# Altium project Marsault1.PrjPcb (part 3 of 7)

## Sheet MEMORIES.SchDoc
size A4; SheetNumber: 3; SheetTotal: 9
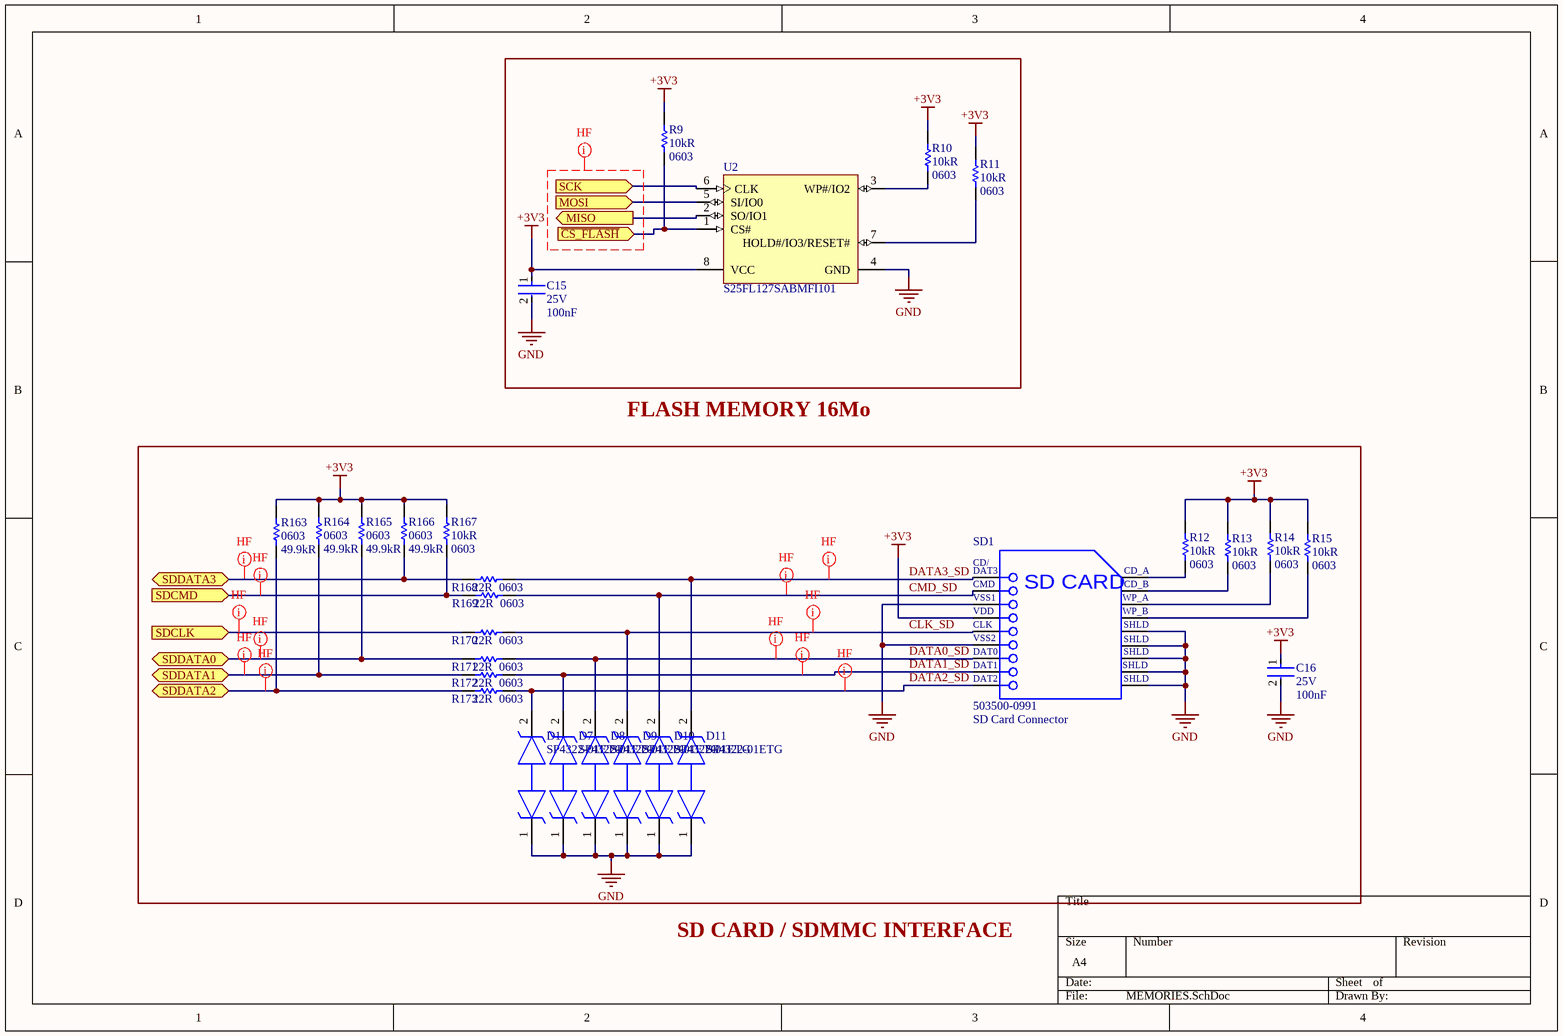
[diagram p2: MEMORIES.SchDoc]

### Parts
C15  Voltage Rating (DC): 25V  Capacitance: 100nF  [FP-CGA3E-0_3-0_1-MFG]  (hidden comment: CGA3E2X7R1E104K080AA)
C16  Voltage Rating (DC): 25V  Capacitance: 100nF  [FP-CGA3E-0_3-0_1-MFG]  (hidden comment: CGA3E2X7R1E104K080AA)
D1  SP4322-01ETG  [SP432201ETG]
D7  SP4322-01ETG  [SP432201ETG]
D8  SP4322-01ETG  [SP432201ETG]
D9  SP4322-01ETG  [SP432201ETG]
D10  SP4322-01ETG  [SP432201ETG]
D11  SP4322-01ETG  [SP432201ETG]
R9  Resistance: 10kR  Case Code (Imperial): 0603  [RESC1609X55X30LL15T15]  (hidden comment: ERJ3EKF1002V)
R10  Resistance: 10kR  Case Code (Imperial): 0603  [RESC1609X55X30LL15T15]  (hidden comment: ERJ3EKF1002V)
R11  Resistance: 10kR  Case Code (Imperial): 0603  [RESC1609X55X30LL15T15]  (hidden comment: ERJ3EKF1002V)
R12  Resistance: 10kR  Case Code (Imperial): 0603  [RESC1609X55X30LL15T15]  (hidden comment: ERJ3EKF1002V)
R13  Resistance: 10kR  Case Code (Imperial): 0603  [RESC1609X55X30LL15T15]  (hidden comment: ERJ3EKF1002V)
R14  Resistance: 10kR  Case Code (Imperial): 0603  [RESC1609X55X30LL15T15]  (hidden comment: ERJ3EKF1002V)
R15  Resistance: 10kR  Case Code (Imperial): 0603  [RESC1609X55X30LL15T15]  (hidden comment: ERJ3EKF1002V)
R163  Case Code (Imperial): 0603  Resistance: 49.9kR  [RESC1608X55X30ML15T15]  (hidden comment: ERJ-3EKF4992V)
R164  Case Code (Imperial): 0603  Resistance: 49.9kR  [RESC1608X55X30ML15T15]  (hidden comment: ERJ-3EKF4992V)
R165  Case Code (Imperial): 0603  Resistance: 49.9kR  [RESC1608X55X30ML15T15]  (hidden comment: ERJ-3EKF4992V)
R166  Case Code (Imperial): 0603  Resistance: 49.9kR  [RESC1608X55X30ML15T15]  (hidden comment: ERJ-3EKF4992V)
R167  Resistance: 10kR  Case Code (Imperial): 0603  [RESC1609X55X30LL15T15]  (hidden comment: ERJ3EKF1002V)
R168  Case Code (Imperial): 0603  Resistance: 22R  [RESC1608X55X30LL15T15]  (hidden comment: ERJ-3EKF22R0V)
R169  Case Code (Imperial): 0603  Resistance: 22R  [RESC1608X55X30LL15T15]  (hidden comment: ERJ-3EKF22R0V)
R170  Case Code (Imperial): 0603  Resistance: 22R  [RESC1608X55X30LL15T15]  (hidden comment: ERJ-3EKF22R0V)
R171  Case Code (Imperial): 0603  Resistance: 22R  [RESC1608X55X30LL15T15]  (hidden comment: ERJ-3EKF22R0V)
R172  Case Code (Imperial): 0603  Resistance: 22R  [RESC1608X55X30LL15T15]  (hidden comment: ERJ-3EKF22R0V)
R173  Case Code (Imperial): 0603  Resistance: 22R  [RESC1608X55X30LL15T15]  (hidden comment: ERJ-3EKF22R0V)
SD1  503500-0991  PackageDescription: SD Card Connector  [MOLX-503500-0991_V]
U2  S25FL127SABMFI101  [SPSN-SO-8_M]

### Ports
MISO (out), MOSI (in), SCK (in), SDCLK (in), SDCMD (in), SDDATA0 (bidir), SDDATA1 (bidir), SDDATA2 (bidir), SDDATA3 (bidir), ~{CS_FLASH} (in)

### Nets
+3V3: C15.1 C16.1 R9.2 R10.2 R11.2 R12.2 R13.2 R14.2 R15.2 R163.2 R164.2 R165.2 R166.2 R167.2 SD1.4(VDD) U2.8(VCC)
GND: C15.2 C16.2 D1.1 D7.1 D8.1 D9.1 D10.1 D11.1 SD1.3(VSS1) SD1.6(VSS2) SD1.14(SHLD1) SD1.15(SHLD2) SD1.16(SHLD3) SD1.17(SHLD4) SD1.18(SHLD5) U2.4(GND)
~{CS_FLASH}: R9.1 U2.1(CS#) ; port ~{CS_FLASH}
CLK_SD: D9.2 R170.2 SD1.5(CLK)
CMD_SD: D10.2 R169.2 SD1.2(CMD)
DATA0_SD: D8.2 R171.2 SD1.7(DAT0)
DATA1_SD: D7.2 R172.2 SD1.8(DAT1)
DATA2_SD: D1.2 R173.2 SD1.9(DAT2)
DATA3_SD: D11.2 R168.2 SD1.1(CD/DAT3)
MISO_MEM: U2.2(SO/IO1) ; port MISO
MOSI_MEM: U2.5(SI/IO0) ; port MOSI
SCK_MEM: U2.6(CLK) ; port SCK
SDCLK: R170.1 ; port SDCLK
SDCMD: R167.1 R169.1 ; port SDCMD
SDDATA0: R165.1 R171.1 ; port SDDATA0
SDDATA1: R164.1 R172.1 ; port SDDATA1
SDDATA2: R163.1 R173.1 ; port SDDATA2
SDDATA3: R166.1 R168.1 ; port SDDATA3
NetR10_1: R10.1 U2.3(WP#/IO2)
NetR11_1: R11.1 U2.7(HOLD#/IO3/RESET#)
NetR12_1: R12.1 SD1.10(CD_A)
NetR13_1: R13.1 SD1.11(CD_B)
NetR14_1: R14.1 SD1.12(WP_A)
NetR15_1: R15.1 SD1.13(WP_B)

### Layout directives
net class HF: (no net found under the mark), CLK_SD, CMD_SD, DATA0_SD, DATA1_SD, DATA2_SD, DATA3_SD, SDCLK, SDCMD, SDDATA0, SDDATA1, SDDATA2, SDDATA3

### Notes on the sheet
- FLASH MEMORY 16Mo
- SD CARD / SDMMC INTERFACE
- (in symbol CMP-1676-00006-1) CD/; DAT3; SD CARD; SHLD

### Library data of the parts
C15 C16 = CMP-08246-002186-1: Cap Ceramic 100nF 25V X7R 10% Pad SMD 0603 +125°C Automotive T/R; Manufacturer: TDK; Composition: Ceramic; Dielectric: X7R; Ratings: AEC-Q200; Length: 1.6mm; REACH SVHC: No SVHC; Width: 0.031inch; Packaging: Tape and Reel; Case/Package: 0603; Height: 0.8mm; Termination: SMD/SMT; Max Operating Temperature: 125°C; Thickness: 0.035inch; Case Code (Metric): 1608; Lead Free: Lead Free; Mount: Surface Mount; Voltage Rating: 25V; Tolerance: 10%; Weight: 7.1E-05oz; Min Operating Temperature: -55°C; Package Quantity: 1; Depth: 0.8mm; Case Code (Imperial): 0603; Supplier 1: Mouser; Supplier Part Number 1: 810-CGA3E2X7R1E104K; Manufacturer Part Number: CGA3E2X7R1E104K080AA; RoHS: Yes; Category: Ceramic Capacitors; Stock 1: 488891; Pricing 1: 1=0,12000, 10=0,05600, 50=0,05600, 100=0,02500, 1000=0,01400, 10000=0,01000 (USD); Series: CGA; Resistor Type: Ceramic; RoHS Compliant: Yes; ComponentLink1URL: https://datasheet.ciiva.com/24220/cga3e2x7r1e104k080aa-265934-24220022.pdf?src-supplier=Mouser; ComponentLink1Description: https://datasheet.ciiva.com/24220/cga3e2x7r1e104k080aa-265934-24220022.pdf?src-supplier=Mouser; ComponentLink2URL: https://datasheet.ciiva.com/22725/1735392-22725638.pdf?src-supplier=Element14; ComponentLink2Description: https://datasheet.ciiva.com/22725/1735392-22725638.pdf?src-supplier=Element14; ComponentLink3URL: https://datasheet.ciiva.com/22725/1735392-22725639.pdf?src-supplier=Element14; ComponentLink3Description: https://datasheet.ciiva.com/22725/1735392-22725639.pdf?src-supplier=Element14; ComponentLink4URL: https://datasheet.ciiva.com/16427/mlccspec-automotive-general-midvoltage-en-16427320.pdf?src-supplier=Future+Electronics; ComponentLink4Description: https://datasheet.ciiva.com/16427/mlccspec-automotive-general-midvoltage-en-16427320.pdf?src-supplier=Future+Electronics; ComponentLink5URL: https://datasheet.ciiva.com/23803/1735392-23803082.pdf?src-supplier=Newark; ComponentLink5Description: https://datasheet.ciiva.com/23803/1735392-23803082.pdf?src-supplier=Newark
D1 D7-D11 = SP4322-01ETG: TVS Diode (Bi-directional); Manufacturer_Name: LITTELFUSE; Datasheet Link: https://www.littelfuse.com/~/media/electronics/datasheets/tvs_diode_arrays/littelfuse_tvs_diode_array_sp4322_datasheet.pdf.pdf; Height: 0.55mm; Manufacturer_Part_Number: SP4322-01ETG; Mouser Part Number: 576-SP4322-01ETG; Mouser Price/Stock: https://www.mouser.co.uk/ProductDetail/Littelfuse/SP4322-01ETG?qs=GedFDFLaBXEDJ%2FYu5biL0A%3D%3D; Arrow Part Number: SP4322-01ETG; Arrow Price/Stock: https://www.arrow.com/en/products/sp4322-01etg/littelfuse?region=nac
R9-R15 R167 = CMP-1012-00623-3: Chip Resistor, 10 KOhm, +/- 1%, 0.1 W, -55 to 155 degC, 0603 (1608 Metric), RoHS, Tape and Reel; Manufacturer: Panasonic; Manufacturer Part Number: ERJ-3EKF1002V; Voltage Rating: 75V; Power Rating: 100mW; Temperature Coefficient: 100ppm\/degreesC; Case\/Package: 0603; Number of Pins: 2; Package Reference: 603; Depth: 0.8mm; Mount: SurfaceMount; Package Description: 2-Pin Surface Mount Device, Body 1.6 x 0.85 mm; Datasheet Version: 02/2017; Length: 1.6mm; Lead Free: LeadFree; Height: 0.45mm; Number of Terminations: 2; Max Power Dissipation: 100mW; Min Operating Temperature: -55degC; Datasheet URL: https://industrial.panasonic.com/cdbs/www-data/pdf/RDA0000/AOA0000C304.pdf; Termination: SMD/SMT; Case Code (Metric): 1608; Tolerance: 1%; Max Operating Temperature: 155degC; RoHSCompliant: true; Voltage Rating (DC): 75V; Radiation Hardening: No; Packaging: TapeandReel; Composition: ThickFilm; Mounting Technology: SurfaceMount; Manufacturer URL: http://www.panasonic.com/; Width: 0.031inch; REACH SVHC: NoSVHC; Contact Plating: Tin; Military Standard: Not; Package Quantity: 1; Supplier 1: Mouser; Supplier Part Number 1: 667-ERJ-3EKF1002V; RoHS: Yes; Category: Chip SMD Resistors; Stock 1: 20455; Pricing 1: 1=0,10000, 10=0,04000, 50=0,04000, 100=0,01700, 1000=0,00700, 5000=0,00500, 10000=0,00500 (USD); Case/Package: 0603; Size Code: 0603; Resistor Type: Thick Film; Series: ERJ; Resistance Tolerance: 1%; Construction: Rectangular; Features: Automotive AEC-Q200; Technology: THICK FILM; RoHS Compliant: Yes; ComponentLink1URL: https://datasheet.ciiva.com/16511/aoa0000ce2-16511861.pdf?src-supplier=Avnet+Asia; ComponentLink1Description: https://datasheet.ciiva.com/16511/aoa0000ce2-16511861.pdf?src-supplier=Avnet+Asia; ComponentLink2URL: https://datasheet.ciiva.com/46372/1678782-46372725.pdf?src-supplier=Element14; ComponentLink2Description: https://datasheet.ciiva.com/46372/1678782-46372725.pdf?src-supplier=Element14; ComponentLink3URL: https://datasheet.ciiva.com/28514/426256-28514198.pdf?src-supplier=Element14; ComponentLink3Description: https://datasheet.ciiva.com/28514/426256-28514198.pdf?src-supplier=Element14; ComponentLink4URL: https://datasheet.ciiva.com/9194/aoa0000ce2-9194199.pdf?src-supplier=Avnet; ComponentLink4Description: https://datasheet.ciiva.com/9194/aoa0000ce2-9194199.pdf?src-supplier=Avnet; ComponentLink5URL: https://datasheet.ciiva.com/7830/aoa0000ce2-7830729.pdf?src-supplier=Element14; ComponentLink5Description: https://datasheet.ciiva.com/7830/aoa0000ce2-7830729.pdf?src-supplier=Element14; ComponentLink6URL: https://datasheet.ciiva.com/17212/aoa0000ce2-17212105.pdf?src-supplier=Avnet+Europe; ComponentLink6Description: https://datasheet.ciiva.com/17212/aoa0000ce2-17212105.pdf?src-supplier=Avnet+Europe; ComponentLink7URL: https://datasheet.ciiva.com/30208/aoa0000ce2-30208985.pdf?src-supplier=Onlinecomponents.com; ComponentLink7Description: https://datasheet.ciiva.com/30208/aoa0000ce2-30208985.pdf?src-supplier=Onlinecomponents.com; ComponentLink8URL: https://datasheet.ciiva.com/48530/aoa0000ce2-48530988.pdf?src-supplier=Avnet; ComponentLink8Description: https://datasheet.ciiva.com/48530/aoa0000ce2-48530988.pdf?src-supplier=Avnet; ComponentLink9URL: https://datasheet.ciiva.com/24070/aoa0000ce2-24070318.pdf?src-supplier=Mouser; ComponentLink9Description: https://datasheet.ciiva.com/24070/aoa0000ce2-24070318.pdf?src-supplier=Mouser; ComponentLink10URL: https://datasheet.ciiva.com/16759/70260748-16759807.pdf?src-supplier=Allied+Electronics; ComponentLink10Description: https://datasheet.ciiva.com/16759/70260748-16759807.pdf?src-supplier=Allied+Electronics
R163-R166 = CMP-2000-00536-1: Manufacturer: Panasonic; Power Rating: 100mW; Voltage Rating: 75V; Temperature Coefficient: 100ppm/°C; Voltage Rating (DC): 50V; Tolerance: 1%; Part Number: ERJ-3EKF4992V; Supplier 1: Mouser; Supplier Part Number 1: 667-ERJ-3EKF4992V; Manufacturer Part Number: ERJ-3EKF4992V; RoHS: Yes; Category: Chip SMD Resistors; Stock 1: 91; Pricing 1: 1=0,10000, 10=0,03700, 50=0,03700, 100=0,01600, 1000=0,00700, 2500=0,00600, 5000=0,00400, 10000=0,00400 (USD); Mount: Surface Mount; Case/Package: 0603; Case Code (Metric): 1608; Contact Plating: Tin; Weight: 7.1E-05oz; Size Code: 0603; Min Operating Temperature: -55°C; Max Operating Temperature: 155°C; Packaging: Tape and Reel; Package Quantity: 1; Resistor Type: Thick Film; Termination: SMD/SMT; Number of Terminations: 2; Series: ERJ; Max Power Dissipation: 100mW; Features: Automotive AEC-Q200; Resistance Tolerance: 1%; Construction: Rectangular; Technology: THICK FILM; Length: 1.6mm; Width: 0.8mm; Height: 0.45mm; Depth: 0.8mm; Radiation Hardening: No; RoHS Compliant: Yes; REACH SVHC: No SVHC; Military Standard: Not; Lead Free: Lead Free; ComponentLink1URL: https://datasheet.ciiva.com/27055/1988209-27055691.pdf?src-supplier=Jameco; ComponentLink1Description: https://datasheet.ciiva.com/27055/1988209-27055691.pdf?src-supplier=Jameco; ComponentLink2URL: https://datasheet.ciiva.com/43460/426256-43460597.pdf?src-supplier=Farnell; ComponentLink2Description: https://datasheet.ciiva.com/43460/426256-43460597.pdf?src-supplier=Farnell; ComponentLink3URL: https://datasheet.ciiva.com/6064/426256-6064568.pdf?src-supplier=Farnell; ComponentLink3Description: https://datasheet.ciiva.com/6064/426256-6064568.pdf?src-supplier=Farnell; ComponentLink4URL: https://datasheet.ciiva.com/46377/426256-46377973.pdf?src-supplier=Element14; ComponentLink4Description: https://datasheet.ciiva.com/46377/426256-46377973.pdf?src-supplier=Element14; ComponentLink5URL: https://datasheet.ciiva.com/28694/1678782-28694218.pdf?src-supplier=Element14; ComponentLink5Description: https://datasheet.ciiva.com/28694/1678782-28694218.pdf?src-supplier=Element14; ComponentLink6URL: https://datasheet.ciiva.com/16440/aoa0000ce2-16440183.pdf?src-supplier=Future+Electronics; ComponentLink6Description: https://datasheet.ciiva.com/16440/aoa0000ce2-16440183.pdf?src-supplier=Future+Electronics; ComponentLink7URL: https://datasheet.ciiva.com/48531/aoa0000ce2-48531016.pdf?src-supplier=Avnet; ComponentLink7Description: https://datasheet.ciiva.com/48531/aoa0000ce2-48531016.pdf?src-supplier=Avnet; ComponentLink8URL: https://datasheet.ciiva.com/30147/aoa0000ce2-30147900.pdf?src-supplier=Onlinecomponents.com; ComponentLink8Description: https://datasheet.ciiva.com/30147/aoa0000ce2-30147900.pdf?src-supplier=Onlinecomponents.com; ComponentLink9URL: https://datasheet.ciiva.com/15159/getdatasheetpartid-52039-15159595.pdf?src-supplier=Verical; ComponentLink9Description: https://datasheet.ciiva.com/15159/getdatasheetpartid-52039-15159595.pdf?src-supplier=Verical; ComponentLink10URL: https://datasheet.ciiva.com/17209/aoa0000ce2-17209495.pdf?src-supplier=Avnet+Europe; ComponentLink10Description: https://datasheet.ciiva.com/17209/aoa0000ce2-17209495.pdf?src-supplier=Avnet+Europe
R168-R173 = CMP-1012-00320-3: Chip Resistor, 22 Ohm, +/- 1%, 0.1 W, -55 to 155 degC, 0603 (1608 Metric), RoHS, Tape and Reel; Manufacturer: Panasonic; Manufacturer Part Number: ERJ3EKF22R0V; Temperature Coefficient: 100ppm/°C; Max Power Dissipation: 100mW; Voltage Rating: 75V; PackageReference: 0603; ComponentLink2URL: http://industrial.panasonic.com/cdbs/www-data/pdf/RDA0000/AOA0000C86.pdf; ComponentLink2Description: Datasheet; PackageDescription: 2-Pin Surface Mount Device, Body 1.6 x 0.85 mm; ComponentLink1URL: http://www.panasonic.com/; ComponentLink1Description: Manufacturer URL; DatasheetVersion: Apr-15; Supplier 1: Mouser; Supplier Part Number 1: 667-ERJ-3EKF22R0V; RoHS: Yes; Category: Chip SMD Resistors; Stock 1: 19455; Pricing 1: 1=0,10000, 10=0,04000, 50=0,04000, 100=0,01700, 1000=0,00900, 5000=0,00400, 10000=0,00400 (USD); Mount: Surface Mount; Case/Package: 0603; Number of Pins: 2; Case Code (Metric): 1608; Weight: 7.1E-05oz; Contact Plating: Tin; Min Operating Temperature: -55°C; Max Operating Temperature: 155°C; Packaging: Tape and Reel; Tolerance: 1%; Resistor Type: Thick Film; Number of Terminations: 2; Power Rating: 100mW; Package Quantity: 5000; Termination: SMD/SMT; Series: ERJ; Resistance Tolerance: 1%; Voltage Rating (DC): 75V; Features: Automotive AEC-Q200; Construction: Rectangular; Length: 1.6mm; Width: 0.8mm; Height: 0.45mm; Depth: 0.8mm; Radiation Hardening: No; RoHS Compliant: Yes; REACH SVHC: No SVHC; Military Standard: Not; Lead Free: Lead Free; ComponentLink3URL: https://datasheet.ciiva.com/5868/aoa0000ce2-5868139.pdf?src-supplier=Farnell; ComponentLink3Description: https://datasheet.ciiva.com/5868/aoa0000ce2-5868139.pdf?src-supplier=Farnell; ComponentLink4URL: https://datasheet.ciiva.com/22674/1678782-22674425.pdf?src-supplier=Element14; ComponentLink4Description: https://datasheet.ciiva.com/22674/1678782-22674425.pdf?src-supplier=Element14; ComponentLink5URL: https://datasheet.ciiva.com/22687/1678782-22687388.pdf?src-supplier=Element14; ComponentLink5Description: https://datasheet.ciiva.com/22687/1678782-22687388.pdf?src-supplier=Element14; ComponentLink6URL: https://datasheet.ciiva.com/46446/1678782-46446333.pdf?src-supplier=Element14; ComponentLink6Description: https://datasheet.ciiva.com/46446/1678782-46446333.pdf?src-supplier=Element14
SD1 = CMP-1676-00006-1: SD and Combo Memory Card Connector, 9 Position Surface Mount, -25 to 85 degC, RoHS, Tape and Reel; Manufacturer: Molex; Nominal Supply Current: 3 mA; Max Supply Voltage: 5.5 V; Output Current: 5 mA; Min Supply Voltage: 2.5 V; Case\Package: Axial; Number of Contacts: 9; Connector Type: Connector,Socket; Current Rating: 500mA; Gender: Female; Voltage Rating (AC): 50V; Pitch: 2.5mm; Pins: 3; ComponentLink2Description: Datasheet; REACH SVHC: Unknown; RoHSCompliant: true; Height: 6.95 mm; Max Operating Temperature: 85 degC; ComponentLink2URL: http://www.molex.com/pdm_docs/sd/5035000991_sd.pdf; ComponentLink1URL: http://www.molex.com/; Mount: Through Hole; Packaging: Bulk; Width: 4.8 mm; Length: 5 mm; PackageReference: 503500-0991; ComponentLink1Description: Manufacturer URL; DatasheetVersion: Rev. B, 02/2010; Radiation Hardening: No; Package Quantity: 1500; Min Operating Temperature: -25 degC; Supplier 1: Mouser; Supplier Part Number 1: 538-503500-0991; Manufacturer Part Number: 503500-0991; RoHS: Yes; Category: Memory Connectors; Stock 1: 1336; Pricing 1: 1=5,19000, 10=4,58000, 50=4,58000, 100=3,64000, 500=3,53000, 1000=3,01000, 2500=2,80000, 5000=2,70000, 10000=2,59000 (USD); Contact Material: Copper Alloy,Copper; Contact Plating: Gold; Housing Material: Polymer; Termination: Solder; Orientation: Right Angle; Number of Rows: 1; Series: 503500; Max Voltage Rating (AC): 50V; Number of Circuits: 9; Max Voltage Rating (DC): 50V; Depth: 27.8mm; RoHS Compliant: Yes; Halogen Free: Low Halogen; ComponentLink3URL: https://datasheet.ciiva.com/1104/ps-503500-001-1104674.pdf?src-supplier=Element14; ComponentLink3Description: https://datasheet.ciiva.com/1104/ps-503500-001-1104674.pdf?src-supplier=Element14; ComponentLink4URL: https://datasheet.ciiva.com/3121/5035000991-memory-card-socket-3121524.pdf?src-supplier=Avnet; ComponentLink4Description: https://datasheet.ciiva.com/3121/5035000991-memory-card-socket-3121524.pdf?src-supplier=Avnet; ComponentLink5URL: https://datasheet.ciiva.com/4581/5035000991-memory-card-socket-152467-4581202.pdf?src-supplier=Mouser; ComponentLink5Description: https://datasheet.ciiva.com/4581/5035000991-memory-card-socket-152467-4581202.pdf?src-supplier=Mouser; ComponentLink6URL: https://datasheet.ciiva.com/46395/1912439-46395610.pdf?src-supplier=Element14; ComponentLink6Description: https://datasheet.ciiva.com/46395/1912439-46395610.pdf?src-supplier=Element14; ComponentLink7URL: https://datasheet.ciiva.com/16547/5035000991-memory-card-socket-16547222.pdf?src-supplier=Avnet+Europe; ComponentLink7Description: https://datasheet.ciiva.com/16547/5035000991-memory-card-socket-16547222.pdf?src-supplier=Avnet+Europe
U2 = CMP-2000-05361-1: MirrorBit(R) Flash Non-Volatile Memory, 128 Mbit, 2.7 to 3.6 V, -40 to 85 degC, 8-Pin SO, Lead (Pb)-free, Tube; Manufacturer: Spansion; Memory Configuration: (NotApplicable); Supply Voltage Min: 2.7V; No. of Pins: 8; Clock Frequency: 108MHz; Supply Voltage Max: 3.6V; SVHC: NoSVHC(19-Dec-2012); IC Interface Type: SPI; Memory Size: 16MB; Memory Case Style: SOIC; Manufacturer URL: http://www.cypress.com/; Datasheet Version: Rev. 02, 04/2013; Operating Temperature Max: 85degC; Datasheet URL: http://datasheet.octopart.com/S25FL127SABMFI101-Spansion-datasheet-16486153.pdf; MSL: MSL3-168hours; Operating Temperature Min: -40degC; Memory Type: Flash